# EAGLE design L298-Breakout_s (EAGLE 6.5.0)
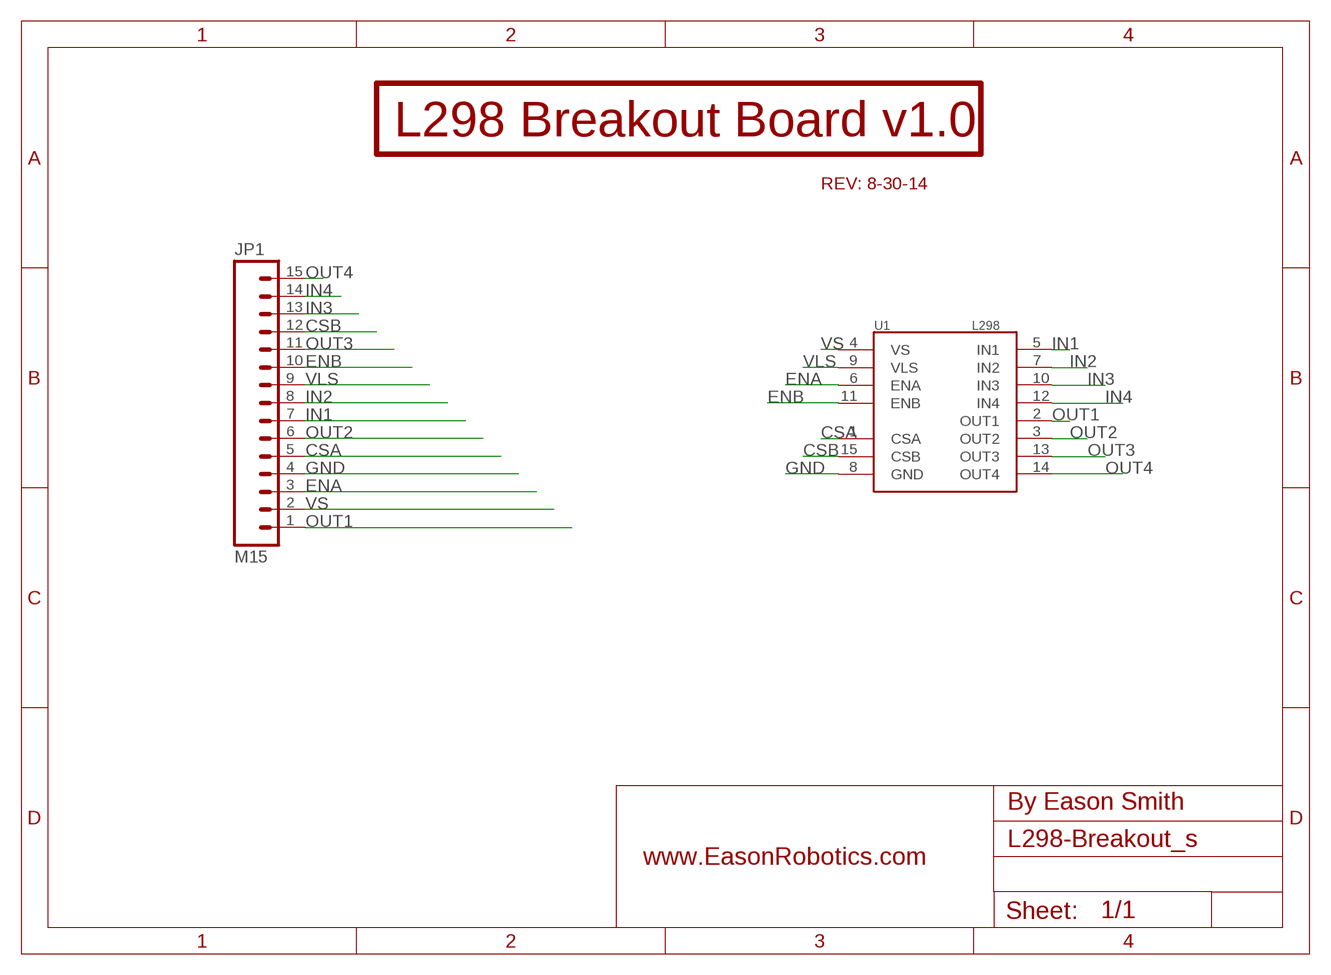
[diagram p0: schematic, sheet 1]

## Parts
JP1  M15  [1X15]
U1  L298  [MULTIWATT15]

## Nets
CSA: JP1.5 U1.1(CSA)
CSB: JP1.12 U1.15(CSB)
ENA: JP1.3 U1.6(ENA)
ENB: JP1.10 U1.11(ENB)
GND: JP1.4 U1.8(GND)
IN1: JP1.7 U1.5(IN1)
IN2: JP1.8 U1.7(IN2)
IN3: JP1.13 U1.10(IN3)
IN4: JP1.14 U1.12(IN4)
OUT1: JP1.1 U1.2(OUT1)
OUT2: JP1.6 U1.3(OUT2)
OUT3: JP1.11 U1.13(OUT3)
OUT4: JP1.15 U1.14(OUT4)
VLS: JP1.9 U1.9(VLS)
VS: JP1.2 U1.4(VS)

## Notes on the sheet
- L298 Breakout Board v1.0
- REV: 8-30-14
- By Eason Smith
- www.EasonRobotics.com

## Library data of the parts
JP1 = SparkFun-Connectors:M15: Header 15 Standard 15-pin 0.1" header. Use with straight break away headers (SKU : PRT-00116), right angle break away headers (PRT-00553), swiss pins (PRT-00743), machine pins (PRT-00117), and female headers (PRT-00115).
U1 = SparkFun-PowerIC:L298: L298 Dual Full Bridge Driver

## Board
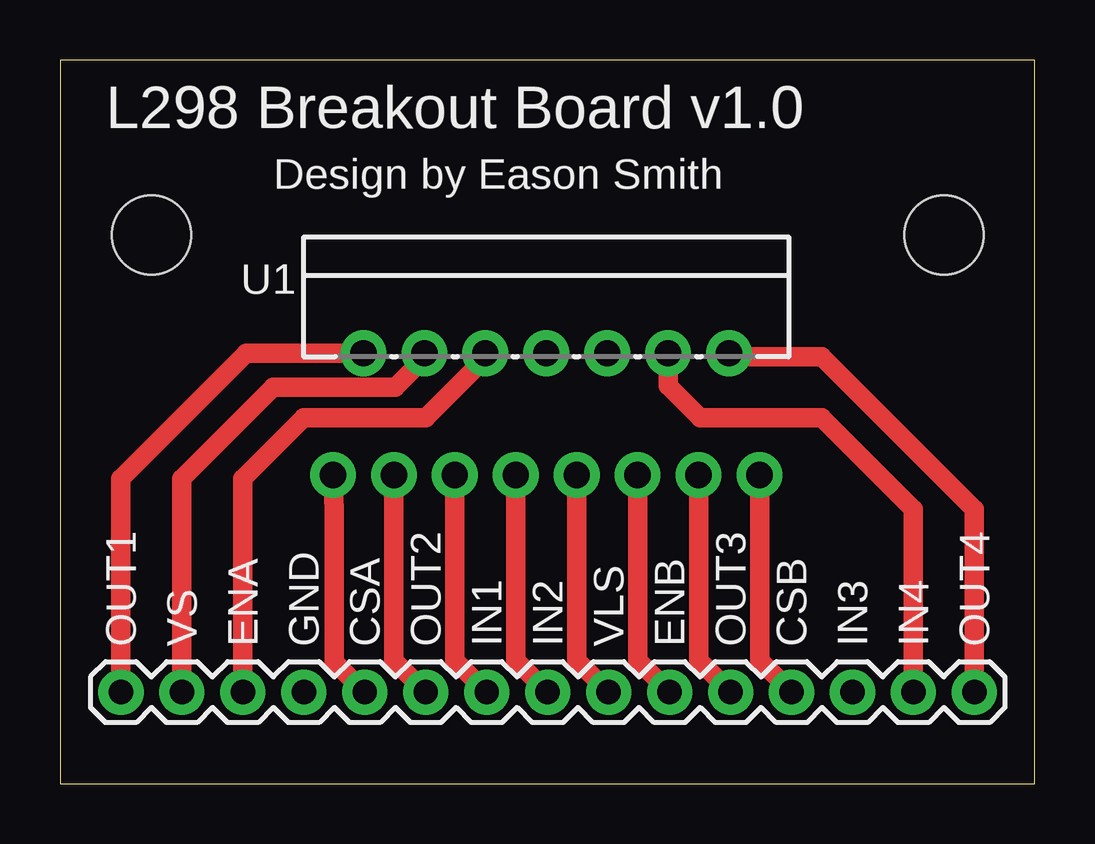
[diagram p1: board, top side]
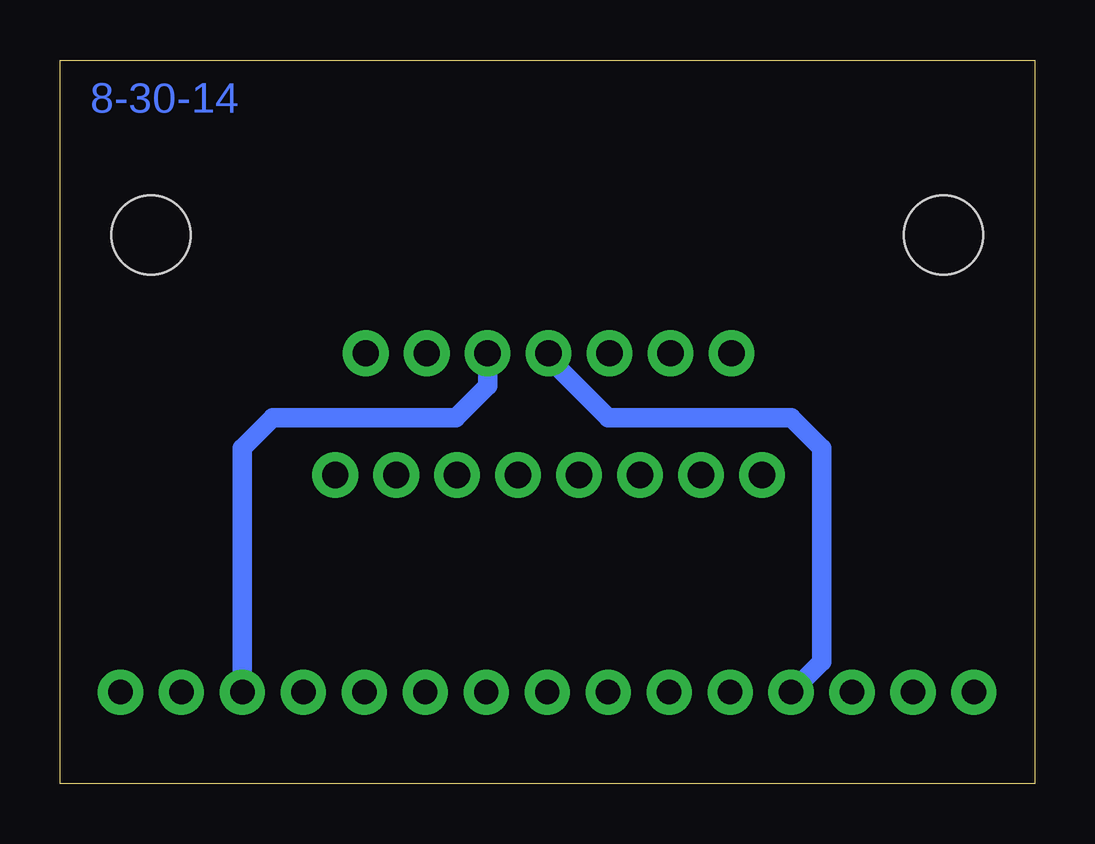
[diagram p2: board, bottom side, seen from below]

Size 40.62 x 30.15 mm. Coordinates in mm from the lower left corner, seen from the top.
Outline: 0,0 40.62,0 40.62,30.15 0,30.15 0,0
Copper layers (1*16): Top 0.035mm / dielectric 1.5mm / Bottom 0.035mm
Design rules "default": minimum track width 10mil, minimum drill 24mil, track to track 8mil, track to pad 8mil, pad to pad 8mil, via to via 8mil, smd to smd 8mil, copper to edge 40mil, drill to drill 8mil, minimum pad ring 10mil, minimum via ring 8mil, stop-mask expansion 4mil, vias tented up to drill 0mil, thermal gap 10mil

### Footprints (pad centres in the part's own frame; a part is rotated, then mirrored left to right if it is on the bottom)
1X15 = drill 1.016 pad 1.88: 1 0,0; 2 2.54,0; 3 5.08,0; 4 7.62,0; 5 10.16,0; 6 12.7,0; 7 15.24,0; 8 17.78,0; 9 20.32,0; 10 22.86,0; 11 25.4,0; 12 27.94,0; 13 30.48,0; 14 33.02,0; 15 35.56,0
MULTIWATT15 = drill 1.1 pad 1.9: 1 -8.95,-2.39; 2 -7.68,2.69; 3 -6.41,-2.39; 4 -5.14,2.69; 5 -3.87,-2.39; 6 -2.6,2.69; 7 -1.33,-2.39; 8 -0.06,2.69; 9 1.21,-2.39; 10 2.48,2.69; 11 3.75,-2.39; 12 5.02,2.69; 13 6.29,-2.39; 14 7.56,2.69; 15 8.83,-2.39
STAND-OFF = hole 3.302: 0,0

### Placement (x,y rotation side)
JP1  2.54,3.81 0 top
U1  20.32,15.24 0 top
U$1  [STAND-OFF]  3.81,22.86 0 top
U$2  [STAND-OFF]  36.83,22.86 0 top

### Tracks (layer width: path | path; a pad name or v marks a point on that pad's centre or on a via)
CSA
  Top 0.203: U1.1 11.37,12.76
  Top 0.813: 11.37,12.76 11.43,11.43 11.43,5.08 JP1.5
CSB
  Top 0.813: U1.15 29.15,5.14 JP1.12
ENA
  Top 0.203: U1.6 17.72,17.72
  Top 0.813: 17.72,17.72 15.24,15.24 10.16,15.24 7.62,12.7 JP1.3
ENB
  Top 0.813: U1.11 24.07,5.14 JP1.10
GND
  Bottom 0.813: U1.8 20.26,17.72 17.78,15.24 10.16,15.24 8.89,13.97 8.89,5.08 JP1.4
IN1
  Top 0.813: U1.5 16.45,5.14 JP1.7
IN2
  Top 0.813: U1.7 18.99,5.14 JP1.8
IN3
  Bottom 0.813: U1.10 22.8,16.57 24.13,15.24 31.75,15.24 33.02,13.97 JP1.13
IN4
  Top 0.813: U1.12 25.34,16.57 26.67,15.24 31.75,15.24 35.56,11.43 JP1.14
OUT1
  Top 0.813: U1.2 7.77,17.93 2.54,12.7 JP1.1
OUT2
  Top 0.813: U1.3 13.91,5.14 JP1.6
OUT3
  Top 0.813: U1.13 26.61,5.14 JP1.11
OUT4
  Top 0.813: JP1.15 38.1,11.43 31.75,17.78 28.03,17.78 U1.14
VLS
  Top 0.813: U1.9 21.53,5.14 JP1.9
VS
  Top 0.203: U1.4 15.18,17.72
  Top 0.813: 15.18,17.72 13.97,16.51 8.89,16.51 5.08,12.7 JP1.2

### Text on the board
Bottom: 8-30-14
tPlace: L298 Breakout Board v1.0 | Design by Eason Smith | OUT1 | VS | ENA | GND | CSA | OUT2 | IN1 | IN2 | VLS | ENB | OUT3 | CSB | IN3 | IN4 | OUT4